# EAGLE design 1541-II multi-ROM Rev2 (EAGLE 9.7.0)
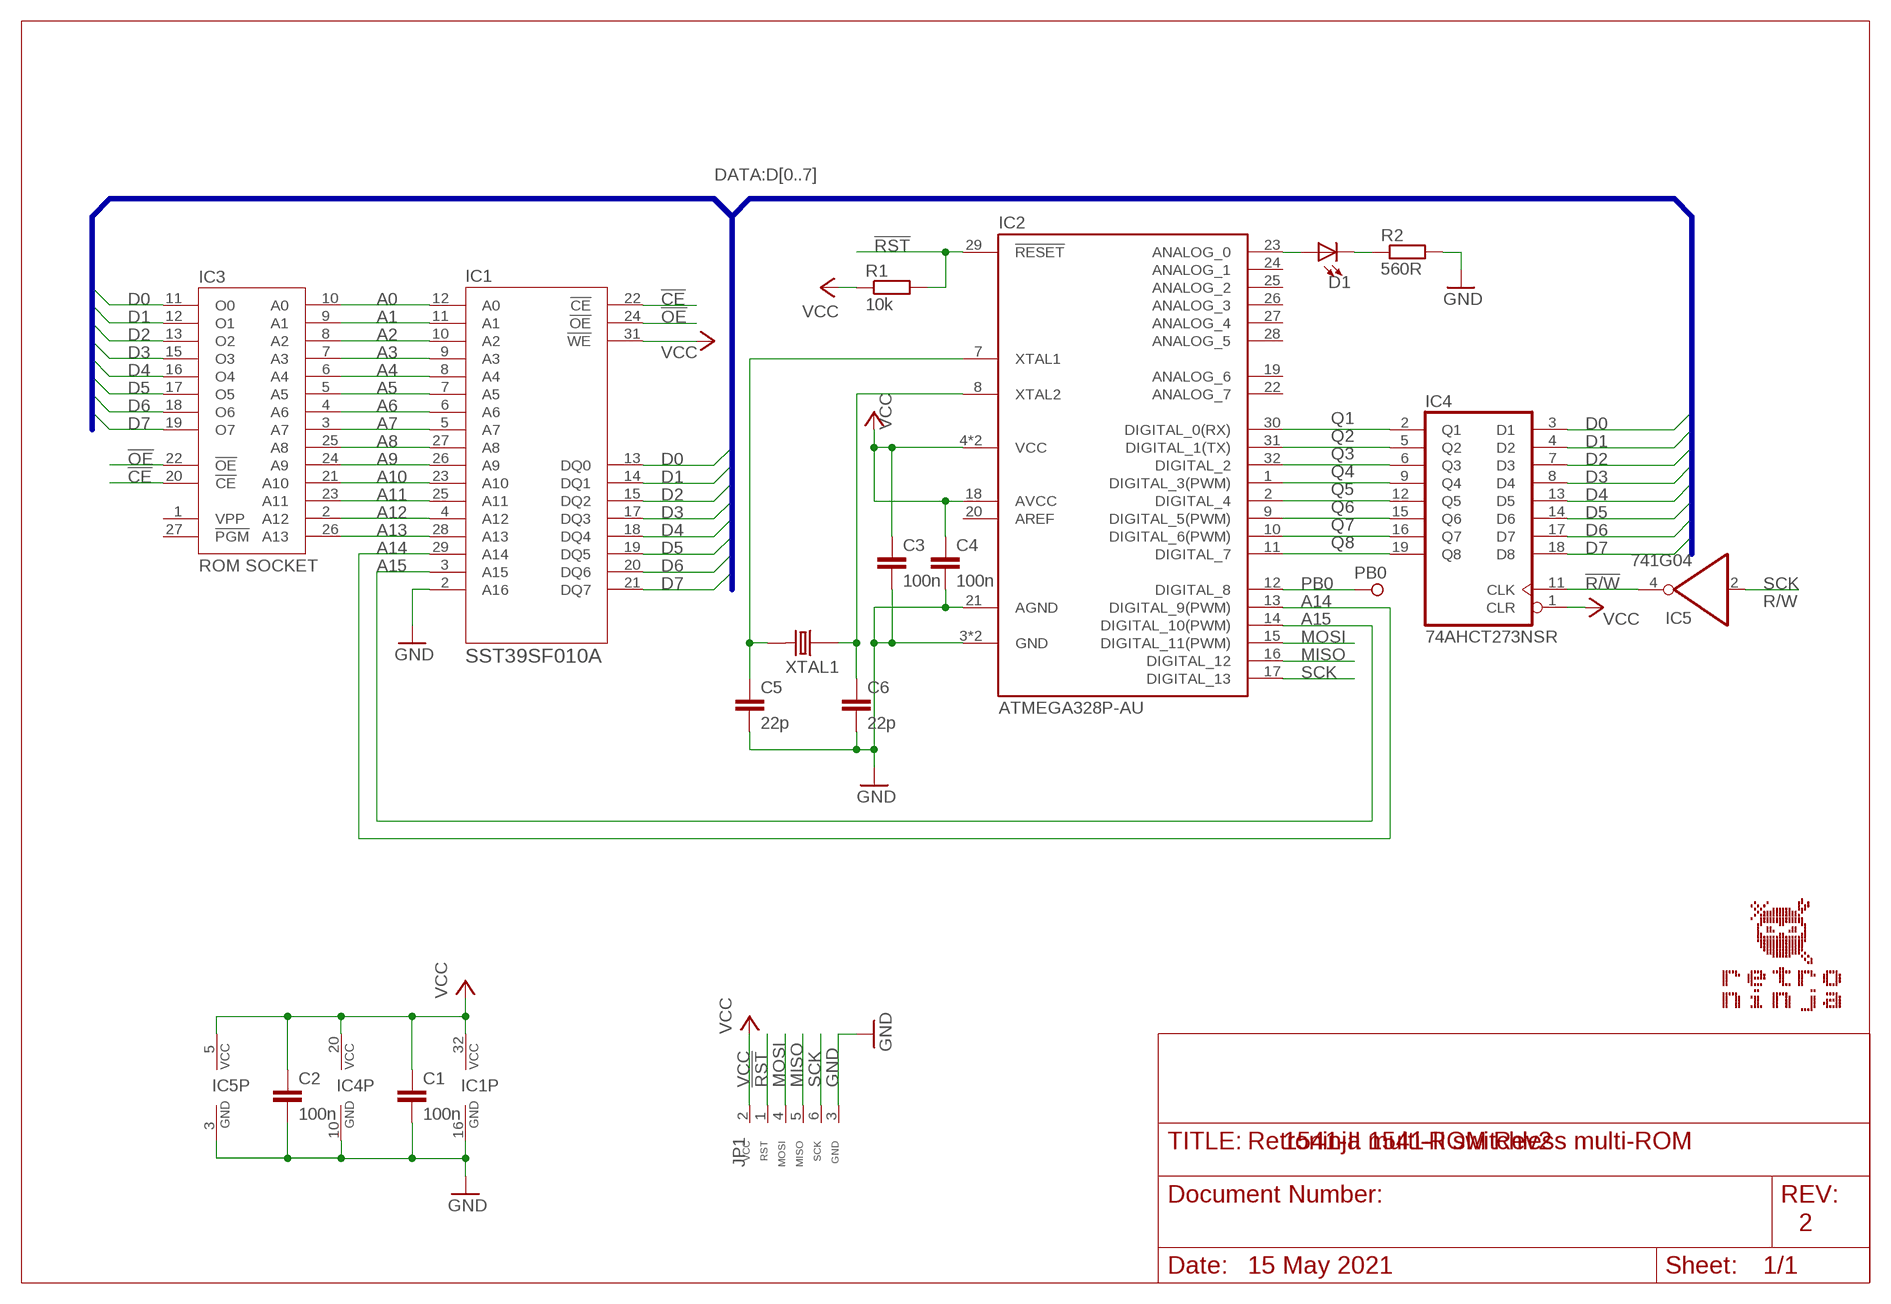
[diagram p0: schematic, sheet 1]

## Parts
C1  100n  C-EUC0805  [C0805]
C2  100n  C-EUC0805  [C0805]
C3  100n  C-EUC0805  [C0805]
C4  100n  C-EUC0805  [C0805]
C5  22p  C-EUC0805  [C0805]
C6  22p  C-EUC0805  [C0805]
D1  LED_1206  [LED1206]
IC1  SST39SF010A  SST39XX010_PLCC_SHORT  [PLCC32_SHORT]
IC2  ATMEGA328P-AU  ARDUINO_168_328_TQFP  [TQFP32]
IC3  ROM SOCKET  27C128_DOWNPINS  [DIL28-6_DOWNPINS]
IC4  74AHCT273NSR  74273NS  [SO20]
IC5  741G04  741G04_SOT23  [SOT23-5]
JP1  ICSP_CONNECTOR_TL866_RIGHT2  [HEADER_1X6_RIGHT]
PB0  TEST_POINT_TH  [TEST_POINT_TH]
R1  10k  R-EU_R0805  [R0805]
R2  560R  R-EU_R0805  [R0805]
XTAL1  CRYSTAL  [CRYSTAL_SMD-2_7X4X2.3]

## Nets
!CE: IC1.22(!CE) IC3.20(!CE)
!OE: IC1.24(!OE) IC3.22(!OE)
!R/W: IC4.11(CLK) IC5.4(O)
!RST: IC2.29(!RESET) JP1.1(RST) R1.2
A0: IC1.12(A0) IC3.10(A0)
A1: IC1.11(A1) IC3.9(A1)
A2: IC1.10(A2) IC3.8(A2)
A3: IC1.9(A3) IC3.7(A3)
A4: IC1.8(A4) IC3.6(A4)
A5: IC1.7(A5) IC3.5(A5)
A6: IC1.6(A6) IC3.4(A6)
A7: IC1.5(A7) IC3.3(A7)
A8: IC1.27(A8) IC3.25(A8)
A9: IC1.26(A9) IC3.24(A9)
A10: IC1.23(A10) IC3.21(A10)
A11: IC1.25(A11) IC3.23(A11)
A12: IC1.4(A12) IC3.2(A12)
A13: IC1.28(A13) IC3.26(A13)
A14: IC1.29(A14) IC2.13(DIGITAL_9(PWM))
A15: IC1.3(A15) IC2.14(DIGITAL_10(PWM))
D0: IC1.13(DQ0) IC3.11(O0) IC4.3(D1)
D1: IC1.14(DQ1) IC3.12(O1) IC4.4(D2)
D2: IC1.15(DQ2) IC3.13(O2) IC4.7(D3)
D3: IC1.17(DQ3) IC3.15(O3) IC4.8(D4)
D4: IC1.18(DQ4) IC3.16(O4) IC4.13(D5)
D5: IC1.19(DQ5) IC3.17(O5) IC4.14(D6)
D6: IC1.20(DQ6) IC3.18(O6) IC4.17(D7)
D7: IC1.21(DQ7) IC3.19(O7) IC4.18(D8)
GND: C1.2 C2.2 C3.2 C4.2 C5.2 C6.2 IC1.2(A16) IC1.16(GND) IC2.3(GND) IC2.5(GND) IC2.21(AGND) IC4.10(GND) IC5.3(GND) JP1.3(GND) R2.2
MISO: IC2.16(DIGITAL_12) JP1.5(MISO)
MOSI: IC2.15(DIGITAL_11(PWM)) JP1.4(MOSI)
N$16: C6.1 IC2.8(XTAL2) XTAL1.1
N$17: C5.1 IC2.7(XTAL1) XTAL1.2
N$25: D1.A IC2.23(ANALOG_0)
N$26: D1.C R2.1
PB0: IC2.12(DIGITAL_8) PB0.P$1(TP)
Q1: IC2.30(DIGITAL_0(RX)) IC4.2(Q1)
Q2: IC2.31(DIGITAL_1(TX)) IC4.5(Q2)
Q3: IC2.32(DIGITAL_2) IC4.6(Q3)
Q4: IC2.1(DIGITAL_3(PWM)) IC4.9(Q4)
Q5: IC2.2(DIGITAL_4) IC4.12(Q5)
Q6: IC2.9(DIGITAL_5(PWM)) IC4.15(Q6)
Q7: IC2.10(DIGITAL_6(PWM)) IC4.16(Q7)
Q8: IC2.11(DIGITAL_7) IC4.19(Q8)
SCK: IC2.17(DIGITAL_13) IC5.2(I) JP1.6(SCK)
VCC: C1.1 C2.1 C3.1 C4.1 IC1.31(!WE) IC1.32(VCC) IC2.4(VCC) IC2.6(VCC) IC2.18(AVCC) IC4.1(CLR) IC4.20(VCC) IC5.5(VCC) JP1.2(VCC) R1.1
Unconnected: IC2.19(ANALOG_6) IC2.20(AREF) IC2.22(ANALOG_7) IC2.24(ANALOG_1) IC2.25(ANALOG_2) IC2.26(ANALOG_3) IC2.27(ANALOG_4) IC2.28(ANALOG_5) IC3.1(VPP) IC3.27(!PGM)

## Buses
DATA:D[0..7]

## Notes on the sheet
- R/W
- Retroninja 1541-II switchless multi-ROM
- 2
- 15 May 2021

## Power pins joined to a net without a drawn wire
GND: IC3.14(GND)
VCC: IC3.28(VCC)

## Library data of the parts
C1-C6 = rcl:C-EU: CAPACITOR, European symbol; SPICEPREFIX: C
D1 = Per (Fusion 360):LED
IC1 = Per (Fusion 360):SST39XX010
IC2 = Per (Fusion 360):ARDUINO_168_328
IC3 = Per (Fusion 360):27C128
IC4 = Per (Fusion 360):74*273
IC5 = Per (Fusion 360):74*1G04
JP1 = Per (Fusion 360):ICSP_CONNECTOR: PIN HEADER
PB0 = Per (Fusion 360):TEST_POINT
R1 R2 = rcl:R-EU_: RESISTOR, European symbol; SPICEPREFIX: R
XTAL1 = Per (Fusion 360):CRYSTAL

## Board
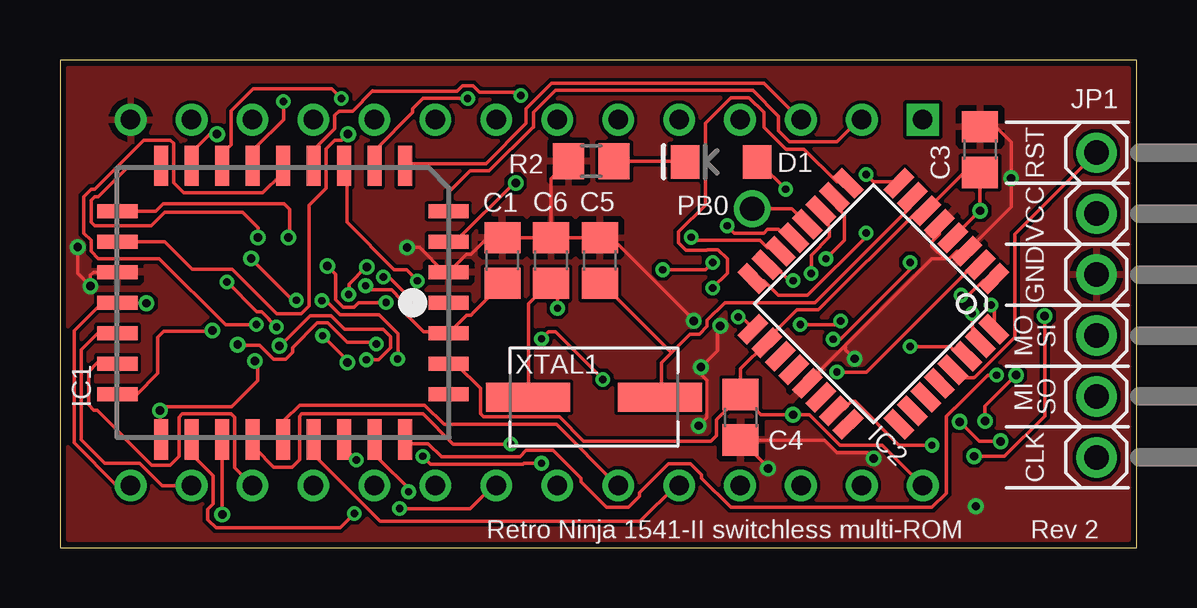
[diagram p1: board, top side]
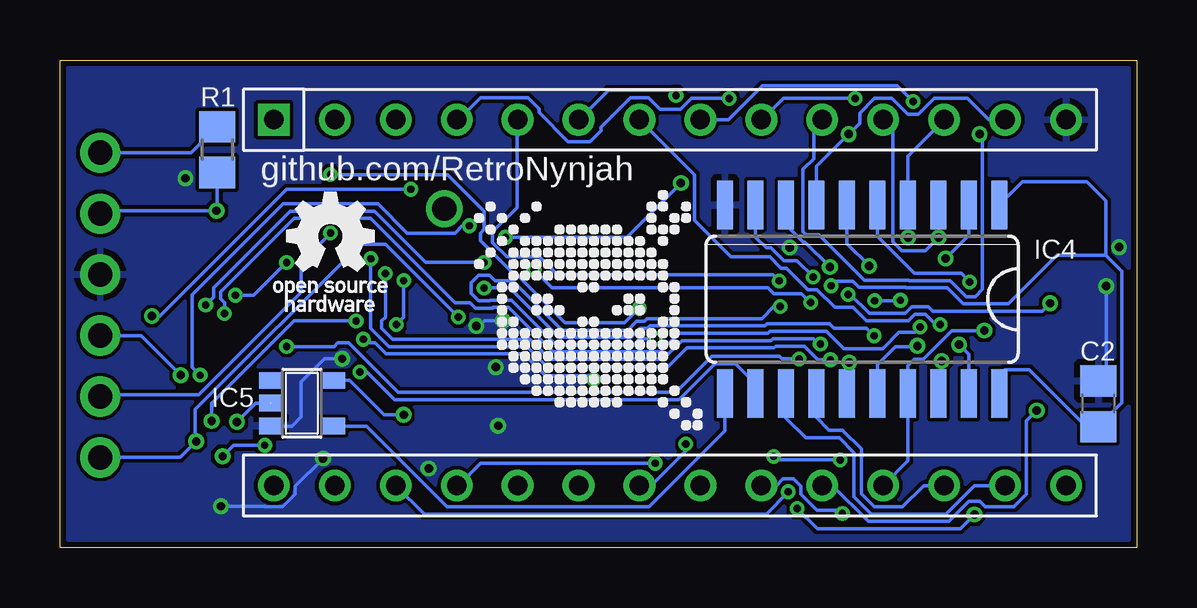
[diagram p2: board, bottom side, seen from below]

Size 44.88 x 20.32 mm. Coordinates in mm from the lower left corner, seen from the top.
Outline: 0,0 44.88,0 44.88,20.32 0,20.32 0,0
Copper layers (1*16): Top 0.035mm / dielectric 1.5mm / Bottom 0.035mm
Design rules "SeeedStudio_2layer_DRU_no_angle_20140221": minimum track width 6mil, minimum drill 12mil, track to track 6mil, track to pad 6mil, pad to pad 6mil, via to via 6mil, smd to smd 0mil, copper to edge 10mil, drill to drill 10mil, minimum pad ring 10mil, minimum via ring 6mil, stop-mask expansion 2mil, vias tented up to drill 100mil, thermal gap 10mil

### Footprints (pad centres in the part's own frame; a part is rotated, then mirrored left to right if it is on the bottom)
C0805 = smd 1.3 x 1.5: 1 -0.95,0; 2 0.95,0
LED1206 = smd 1.2 x 1.4: A -1.5,0; C 1.5,0
PLCC32_SHORT = smd 0.584 x 1.676: 1 0,6.9; 2 -1.27,6.9; 3 -2.54,6.9; 4 -3.81,6.9; 14 -3.81,-6.9; 15 -2.54,-6.9; 16 -1.27,-6.9; 17 0,-6.9; 18 1.27,-6.9; 19 2.54,-6.9; 20 3.81,-6.9; 30 3.81,6.9; 31 2.54,6.9; 32 1.27,6.9 | smd 1.676 x 0.584: 5 -5.7,5.08; 6 -5.7,3.81; 7 -5.7,2.54; 8 -5.7,1.27; 9 -5.7,0; 10 -5.7,-1.27; 11 -5.7,-2.54; 12 -5.7,-3.81; 13 -5.7,-5.08; 21 5.7,-5.08; 22 5.7,-3.81; 23 5.7,-2.54; 24 5.7,-1.27; 25 5.7,0; 26 5.7,1.27; 27 5.7,2.54; 28 5.7,3.81; 29 5.7,5.08
TQFP32 = smd 1.27 x 0.559: 1 -4.293,2.8; 2 -4.293,2; 3 -4.293,1.2; 4 -4.293,0.4; 5 -4.293,-0.4; 6 -4.293,-1.2; 7 -4.293,-2; 8 -4.293,-2.8; 17 4.293,-2.8; 18 4.293,-2; 19 4.293,-1.2; 20 4.293,-0.4; 21 4.293,0.4; 22 4.293,1.2; 23 4.293,2; 24 4.293,2.8 | smd 0.559 x 1.27: 9 -2.8,-4.293; 10 -2,-4.293; 11 -1.2,-4.293; 12 -0.4,-4.293; 13 0.4,-4.293; 14 1.2,-4.293; 15 2,-4.293; 16 2.8,-4.293; 25 2.8,4.293; 26 2,4.293; 27 1.2,4.293; 28 0.4,4.293; 29 -0.4,4.293; 30 -1.2,4.293; 31 -2,4.293; 32 -2.8,4.293
DIL28-6_DOWNPINS = drill 0.813 square: 1 -16.51,-7.62 | drill 0.813: 2 -13.97,-7.62; 3 -11.43,-7.62; 4 -8.89,-7.62; 5 -6.35,-7.62; 6 -3.81,-7.62; 7 -1.27,-7.62; 8 1.27,-7.62; 9 3.81,-7.62; 10 6.35,-7.62; 11 8.89,-7.62; 12 11.43,-7.62; 13 13.97,-7.62; 14 16.51,-7.62; 15 16.51,7.62; 16 13.97,7.62; 17 11.43,7.62; 18 8.89,7.62; 19 6.35,7.62; 20 3.81,7.62; 21 1.27,7.62; 22 -1.27,7.62; 23 -3.81,7.62; 24 -6.35,7.62; 25 -8.89,7.62; 26 -11.43,7.62; 27 -13.97,7.62; 28 -16.51,7.62
SO20 = smd 0.66 x 2.032: 1 -5.369,-4.019; 2 -4.099,-4.019; 3 -2.829,-4.019; 4 -1.559,-4.019; 5 -0.289,-4.019; 6 0.981,-4.019; 7 2.251,-4.019; 8 3.521,-4.019; 9 4.791,-4.019; 10 6.061,-4.019; 11 6.061,3.839; 12 4.791,3.839; 13 3.521,3.839; 14 2.251,3.839; 15 0.981,3.839; 16 -0.289,3.839; 17 -1.559,3.839; 18 -2.829,3.839; 19 -4.099,3.839; 20 -5.369,3.839
SOT23-5 = smd 0.69 x 0.99: 1 -0.95,-1.29; 2 0,-1.29; 3 0.95,-1.29; 4 0.95,1.3; 5 -0.95,1.3
HEADER_1X6_RIGHT = drill 1.016 pad 1.676: 1 -6.35,-1.27; 2 -3.81,-1.27; 3 -1.27,-1.27; 4 1.27,-1.27; 5 3.81,-1.27; 6 6.35,-1.27
TEST_POINT_TH = drill 1.016: P$1 0,0
R0805 = smd 1.3 x 1.5: 1 -0.95,0; 2 0.95,0
CRYSTAL_SMD-2_7X4X2.3 = smd 3.5 x 1.2: 1 -2.75,0; 2 2.75,0

### Placement (x,y rotation side)
C1  18.44,11.96 90 top
C2  1.6,5.99 90 bottom
C3  38.35,16.59 90 top
C4  28.37,5.44 270 top
C5  22.5,11.96 90 top
C6  20.47,11.96 90 top
D1  27.56,16.08 180 top
IC1  9.3,10.21 270 top
IC2  33.91,10.16 225 top
IC3  19.46,10.21 180 top
IC4  11.1,10.26 180 bottom
IC5  34.8,6.02 270 bottom
JP1  44.48,10.11 270 top
PB0  28.85,14.12 0 top
R1  38.33,16.59 90 bottom
R2  22.15,16.1 180 top
U$1  [RETRONINJA_NOTEXT_10MM]  22.86,10.13 0 bottom
U$2  [OSHW_5MM]  35.99,9.83 0 bottom
XTAL1  22.25,6.27 0 top

### Tracks (layer width: path | path; a pad name or v marks a point on that pad's centre or on a via)
!CE  (via drill 0.3)
  Top 0.152: IC1.22 5.56,4.42 5.56,3.81 6.38,3 6.38,1.82 6.16,1.61 6.16,1.17 6.51,0.82 11.67,0.82 v12.27,1.42 | v12.27,1.42
  Bottom 0.152: v12.27,1.42 12.41,1.56 13.33,1.56 13.99,2.22 13.99,2.55 14.31,2.86 14.75,2.86 15.02,2.59 IC3.20
!OE  (via drill 0.3)
  Top 0.152: IC1.24 8.15,4.42 8.15,4.12 8.91,3.35 9.68,3.35 9.98,3.66 9.98,5.49 10.07,5.58 15.13,5.58 16.39,4.32 v18.79,4.32
  Bottom 0.152: v18.79,4.32 18.79,4.04 20.25,2.59 IC3.22
!R/W
  Bottom 0.152: IC5.4 32.11,5.07 28.74,1.7 20.33,1.7 17.16,4.87 IC4.11
!RST
  Top 0.152: IC2.29 37.26,7.32 37.52,7.32 37.74,7.09 38.1,7.09 38.11,7.1 38.14,7.1 39.8,8.76 39.8,13.05 JP1.1
  Bottom 0.152: R1.2 39.41,16.46 JP1.1
A0  (via drill 0.35)
  Top 0.152: v6.55,17.23 6.24,17.23 5.49,16.47 IC1.12
  Bottom 0.152: IC3.10 13.46,17.48 13.46,16.21 13.91,15.76 13.91,13.17 13.78,13.04 13.24,13.04 11.35,11.15 9.51,11.15 9.48,11.12 7.76,11.12 7.1,10.46 6.73,10.46 6.43,10.77 6.43,17.01 6.55,17.13 v6.55,17.23
A1  (via drill 0.3)
  Top 0.152: v11.73,18.72 11.33,19.12 8.06,19.12 7.14,18.2 7.14,16.79 6.76,16.41 IC1.11
  Bottom 0.152: IC3.9 15.62,17.83 14.73,18.72 v11.73,18.72
A2  (via drill 0.3)
  Top 0.152: IC1.10 8.15,16 8.15,16.68 9.31,17.84 v9.31,18.59
  Bottom 0.152: IC3.8 17.02,17.83 15.6,19.25 9.98,19.25 v9.31,18.59
A3  (via drill 0.3)
  Top 0.152: IC1.9 9.22,15.85 9.22,15.54 8.46,14.78 5.16,14.78 4.74,15.21 4.74,16.84 4.6,16.98 3.49,16.98 1.45,14.94 1.29,14.94 0.99,14.63 0.99,13.11 1.29,12.8 1.29,12.34 1.6,12.04 4.14,12.04 6.9,9.28 8.17,9.28 v8.19,9.3
  Bottom 0.152: v8.19,9.3 8.38,9.3 8.81,9.73 9.25,9.73 9.52,9.45 11.27,9.45 11.82,10.01 12.59,10.01 13.33,10.75 13.7,10.75 14.61,11.65 14.83,11.65 15.29,12.11 16.91,12.11 18.44,13.64 18.44,15.54 IC3.7
A4  (via drill 0.3)
  Top 0.152: IC1.8 10.59,16 10.59,16.6 11.46,17.46 11.46,18.01 11.63,18.19 12.19,18.19 13.04,19.03 13.05,19.02 16.54,19.02 16.77,19.25 17.21,19.25 17.48,18.98 19.07,18.98 v19.2,18.85
  Bottom 0.152: v19.2,18.85 19.41,19.05 22.02,19.05 23.24,17.83 IC3.6
A5  (via drill 0.3)
  Top 0.152: IC1.7 11.96,15.85 11.96,13.55 13.94,11.58 14.44,11.58 v14.9,11.12
  Bottom 0.152: IC3.5 25.83,17.83 25.83,14.17 26.84,13.16 26.84,12.71 26.25,12.12 24.89,12.12 24.15,11.37 15.15,11.37 v14.9,11.12
A6  (via drill 0.3)
  Top 0.152: v16.99,18.72 15.14,18.72 14.71,18.29 14.71,18.14 13.18,16.61 13.18,16 IC1.6
  Bottom 0.152: v16.99,18.72 18.57,18.72 19.02,18.26 19.86,18.26 20.34,18.75 21.11,18.75 22.33,17.53 22.33,17.37 22.78,16.92 23.7,16.92 24.92,18.14 24.92,18.29 25.38,18.75 27.36,18.75 28.27,17.83 IC3.4
A7
  Top 0.152: IC1.5 14.4,16 17.75,16 19.43,17.68 19.43,18.29 20.5,19.36 29.34,19.36 30.86,17.83 IC3.3
A8  (via drill 0.3)
  Top 0.152: IC1.27 11.84,4.16 12.34,3.66 v12.36,3.66 | v20.07,3.52 19.33,3.52 19.3,3.48 15.45,3.48 v15.13,3.81
  Bottom 0.152: IC3.25 28.27,2.59 27.34,3.52 v20.07,3.52 | v15.13,3.81 14.97,3.66 v12.36,3.66
A9
  Top 0.152: IC1.26 10.59,4.42 10.59,3.85 13.35,1.09 24.18,1.09 25.68,2.59 IC3.24
A10  (via drill 0.3, 0.35)
  Top 0.152: IC3.21 18.06,2.59 17.1,1.63 v14.15,1.63 | IC1.23 6.76,1.73 6.76,1.72 v6.76,1.38
  Bottom 0.152: v6.76,1.38 7.36,0.79 13.31,0.79 v14.15,1.63
A11
  Top 0.152: IC1.25 9.37,4.57 9.37,5.33 9.98,5.94 15.2,5.94 16,5.14 20.69,5.14 23.24,2.59 IC3.23
A12
  Top 0.152: IC3.2 33.3,17.83 32.38,16.92 30.4,16.92 29.95,17.37 29.95,17.98 28.88,19.05 20.65,19.05 19.74,18.14 19.74,17.53 19.71,17.53 17.88,15.7 17.09,15.7 16.2,14.8 IC1.4
A13  (via drill 0.3)
  Top 0.152: IC1.28 13.18,4.42 13.18,3.81 14.69,2.3 14.56,2.3 v14.53,2.33
  Bottom 0.152: IC3.26 29.69,1.4 15.44,1.4 14.53,2.31 v14.53,2.33
A14  (via drill 0.3)
  Top 0.152: v27.81,13.41 28.12,13.11 29.34,13.11 29.49,13.26 29.95,13.26 30.25,12.95 30.56,12.95 IC2.13 | v39.04,7.19 38.68,7.19 37.3,5.8 37.27,5.8 36.95,5.47 36.95,2.28 36.35,1.68 27.96,1.68 26.75,2.9 26.75,3.05 26.29,3.5 25.38,3.5 24.16,2.29 24.16,2.13 23.7,1.68 22.78,1.68 21.72,2.74 21.72,2.9 20.56,4.05 19.44,4.05 19.17,3.79 15.9,3.79 15.35,4.34 14.48,4.34 14.4,4.42 IC1.29
  Bottom 0.152: v27.81,13.41 28.12,13.41 28.42,13.11 30.4,13.11 31.62,14.33 35.59,14.33 39.37,10.54 39.37,7.52 v39.04,7.19
A15  (via drill 0.3, 0.35)
  Top 0.152: IC2.14 29.95,12.5 29.49,12.5 29.18,12.8 26.44,12.8 v26.31,12.93 | IC1.3 16.23,12.8 16.54,12.8 18.92,15.19 v19,15.19
  Bottom 0.152: v19,15.19 21.25,12.93 v26.31,12.93
D0  (via drill 0.35)
  Top 0.152: IC1.13 4.19,15.85 2.82,15.85 1.6,14.63 1.45,14.63 1.29,14.48 1.29,13.56 1.45,13.41 3.81,13.41 4.37,13.97 7.62,13.97 8.26,13.34 v8.26,12.93
  Bottom 0.152: IC4.3 8.26,14.27 v8.26,12.93 8.81,12.37 9.78,12.37 10.16,12.75 10.16,17.42 IC3.11
D1  (via drill 0.35)
  Top 0.152: v9.53,12.93 9.58,12.98 9.58,14.1 9.35,14.33 4.29,14.33 3.99,14.02 IC1.14
  Bottom 0.152: v9.53,12.93 9.53,14.27 IC4.4 9.54,16.32 IC3.12
D2  (via drill 0.35)
  Top 0.152: IC1.15 4.37,12.75 5.51,11.61 7.18,11.61 9.04,9.75 10.05,9.75 10.39,10.09 10.39,14.28 11.09,14.98 11.09,16.61 11.45,16.98 11.74,16.98 12,17.23 v12.01,17.23
  Bottom 0.152: IC3.13 6.17,17.83 7.06,18.72 8.43,18.72 9.09,18.06 9.54,18.06 10.2,18.72 10.94,18.72 11.55,18.11 11.55,17.69 v12.01,17.23 13.35,15.89 IC4.7
D3  (via drill 0.3, 0.35)
  Top 0.152: IC3.15 2.36,2.59 0.58,4.37 0.58,9.04 1.75,10.21 IC1.17 2.42,10.19 v3.61,10.19 | v12.03,10.54 12.05,10.56 12.05,10.98 12.77,11.7 v12.79,11.7
  Bottom 0.152: IC4.8 14.62,13.45 13.9,12.73 13.82,12.73 v12.79,11.7 | v12.03,10.54 11.93,10.54 11.14,9.76 9.65,9.76 9.38,10.03 8.68,10.03 8.5,9.86 5.08,9.86 4.65,9.86 3.94,9.86 v3.61,10.19
D4
  Top 0.152: IC1.18 1.57,8.94 0.89,8.26 0.89,4.5 1.87,3.52 3.32,3.52 4.25,2.59 IC3.16
  Bottom 0.152: IC3.16 6.77,2.59 7.96,1.4 11.06,1.4 11.79,2.12 11.79,3.96 12.39,4.57 13.79,4.57 14.62,5.4 IC4.13
D5
  Top 0.152: IC1.19 2.44,7.7 1.56,7.7 1.19,7.34 1.19,5.95 1.41,5.73 1.55,5.73 3.83,3.44 4.6,3.44 4.97,3.81 4.97,5.44 5.1,5.58 7.14,5.58 7.28,5.44 7.28,3.34 IC3.17
  Bottom 0.152: IC3.17 8.88,2.59 9.77,1.7 10.94,1.7 11.48,2.25 11.48,4.12 12.27,4.9 12.83,4.9 13.35,5.43 IC4.14
D6  (via drill 0.35)
  Top 0.152: IC1.20 3.21,6.4 4.08,7.27 4.08,8.77 4.33,9.02 6.32,9.02 v6.35,9.05
  Bottom 0.152: v6.35,9.05 7.7,9.05 8.89,7.85 9.27,7.85 9.54,7.58 IC4.17 9.54,3.62 IC3.18
D7  (via drill 0.35)
  Top 0.152: v8.13,7.78 8.23,7.68 8.23,6.96 7.15,5.88 4.33,5.88 v4.17,5.71 v4.18,5.7 4.18,4.55 IC1.21
  Bottom 0.152: IC3.19 12.69,2.59 11.19,1.09 7.84,1.09 6.99,1.94 6.53,1.94 6.3,1.7 5.12,1.7 4.6,2.22 4.6,5.28 v4.17,5.71 | IC4.18 8.27,6.97 8.13,7.11 v8.13,7.78
GND  (via drill 0.35)
  Top 0.152: IC2.3 38.15,12.7 | C3.2 39,17.54 39.65,16.89 v39.65,15.39 39.65,14.2 IC2.3 | C6.2 C1.2 17.81,12.91 17.13,12.23 16.95,12.23 IC1.2 16.01,11.48 14.98,12.51 v14.47,12.51 | C6.2 C5.2 22.99,12.91 26.21,9.69 26.21,9.65 v26.42,9.45 | IC1.16 1.4,11.48 1.27,11.35 v1.27,10.9 0.74,11.43 v0.74,12.52 | C6.2 20.47,15.38 R2.2 | 36.88,12.04 36.35,12.57 36.35,12.76 36.66,13.06 IC2.5 | 36.88,12.04 37.07,12.04 37.38,12.35 IC2.3 | 32.74,8.43 IC2.21 | 32.74,8.43 36.35,12.04 36.88,12.04 | v33.92,3.71 33.66,3.96 32.38,3.96 31.86,4.49 C4.2 29.52,3.34 v29.52,3.3 | v33.12,7.87 32.74,8.25 32.74,8.43 | v26.62,5.08 26.98,5.44 26.98,6.97 26.72,7.23 v26.72,7.52 27.4,8.2 27.4,9.12 v27.53,9.24
  Bottom 0.152: C2.2 1.27,7.28 v1.27,10.9 | IC5.3 35.2,5.07 34.82,5.45 34.82,6.91 33.86,7.87 v33.12,7.87 | v33.92,3.71 35.08,2.55 35.08,2.22 35.6,1.7 36.34,1.7 36.36,1.73 v38.18,1.73 | v27.53,9.24 27.4,9.24 27.19,9.45 v26.42,9.45
  pour Top: 44.91,20.4 -0.08,20.4 -0.08,-0.08 44.91,-0.08
  pour Bottom: 44.91,20.47 -0.08,20.47 -0.08,-0.08 44.91,-0.08
MISO  (via drill 0.3)
  Top 0.152: v33.6,13.11 33.6,12.95 31.17,10.52 29.95,10.52 29.34,11.12 29.03,11.12 IC2.16
  Bottom 0.152: v33.6,13.11 34.82,11.89 34.82,10.64 39.09,6.38 43.13,6.38 JP1.5
MOSI  (via drill 0.3, 0.35)
  Top 0.152: v30.56,11.12 30.4,11.12 29.79,11.73 29.49,11.73 IC2.15 | v30.86,9.3 32.38,9.3 v32.54,9.45 | v38.56,5.28 38.56,5.89 v39.85,7.19
  Bottom 0.152: v30.56,11.12 30.56,9.6 v30.86,9.3 | v32.54,9.45 35.13,9.45 38.56,6.02 v38.56,5.28 | v39.85,7.19 41.5,8.84 JP1.4
N$16  (via drill 0.3)
  Top 0.152: v33.6,15.54 33.91,15.24 34.82,15.24 IC2.8 | XTAL1.1 19.53,6.31 19.53,10.16 20.34,10.97 C6.1 20.74,10.75 v20.74,9.97
  Bottom 0.152: v33.6,15.54 28.73,15.54 27.2,14.02 27.2,13.26 27.36,13.11 27.36,12.79 25.99,11.43 25.88,11.43 23.83,9.37 21.34,9.37 v20.74,9.97
N$17
  Top 0.152: 25.49,8.12 25.07,7.7 25.07,6.4 XTAL1.2 | IC2.7 35.43,14.48 35.43,14.17 31.47,10.21 27.71,10.21 26.97,9.47 26.97,9.22 26.65,8.9 26.27,8.9 25.49,8.12 | 25.49,8.12 22.63,10.97 C5.1
N$25  (via drill 0.3, 0.35)
  Top 0.152: v36.35,4.27 34.98,4.27 33.15,6.1 32.99,6.1 32.69,5.79 32.38,5.79 IC2.23 | v30.25,14.94 29.18,16 D1.A | v38.1,3.81 39.37,3.81 41.05,5.49 v41.05,9.65
  Bottom 0.152: v30.25,14.94 35.43,14.94 40.72,9.65 v41.05,9.65 | v36.35,4.27 37.64,4.27 v38.1,3.81
N$26
  Top 0.152: R2.1 26.03,16.1 D1.C
PB0
  Top 0.152: IC2.12 30.51,14.12 PB0.P$1
Q1  (via drill 0.3, 0.35)
  Top 0.152: v35.43,8.38 37.11,8.38 37.41,8.08 37.72,8.08 IC2.30 | v10.92,10.29 11.1,10.29 11.69,9.71 13.3,9.71 14.09,8.92 14.09,7.88 v14.07,7.87 | v7.97,12.05 9.71,10.31 v9.85,10.31
  Bottom 0.152: v35.43,8.38 33.45,8.38 33.3,8.53 32.84,8.53 30.79,6.48 19.21,6.48 17.71,7.97 14.89,7.97 14.78,7.87 v14.07,7.87 | v7.97,12.05 7,13.01 IC4.2 | v10.92,10.29 9.87,10.29 v9.85,10.31
Q2  (via drill 0.3)
  Top 0.152: v38.02,9.75 38.02,8.99 38.33,8.69 IC2.31 | v6.96,11.07 8.2,9.84 8.41,9.84 8.73,9.53 8.73,9.5 v9.03,9.2
  Bottom 0.152: v38.02,9.75 38.02,10.21 38.18,10.36 38.18,10.67 35.13,13.72 31.93,13.72 28.42,10.21 27.78,10.21 27.55,9.98 26.86,9.98 26.83,10.01 26.19,10.01 24.33,8.15 19.87,8.15 19.09,8.93 15.37,8.93 15.28,9.02 12.93,9.02 12.21,8.3 10.58,8.3 9.9,8.97 9.26,8.97 v9.03,9.2 | v6.96,11.07 7.32,11.43 9.27,11.43 10.81,12.97 IC4.5
Q3  (via drill 0.3, 0.35)
  Top 0.152: v38.81,10.11 38.94,9.98 38.94,9.14 IC2.32 | v25.12,11.58 26.9,11.58 v27.2,11.89 | v13.59,10.21 12.46,10.21 12.25,10.01 11.81,10.01 11.5,10.32 11.5,11.39 v11.15,11.74
  Bottom 0.152: v38.81,10.11 38.48,10.44 38.48,10.82 35.28,14.02 31.77,14.02 29.64,11.89 v27.2,11.89 | v25.12,11.58 24.38,10.84 15.38,10.84 15.12,10.59 13.97,10.59 13.83,10.44 13.82,10.44 v13.59,10.21 | v11.15,11.74 12.08,12.67 IC4.6
Q4  (via drill 0.3)
  Top 0.152: v37.57,10.52 37.87,10.52 38.48,11.12 38.79,11.12 IC2.1 | v35.43,11.89 35.43,11.58 32.54,8.69 v32.23,8.69 | v13.48,11.28 v13.49,11.28 13.72,11.28 14.86,10.13 v14.86,10.05 | v22.63,7.01 20.65,8.99 20.36,8.99 v20.07,8.7
  Bottom 0.152: v37.57,10.52 36.8,10.52 v35.43,11.89 | v32.23,8.69 32.08,8.53 31.75,8.53 31.29,8.08 25.55,8.08 24.63,7.16 22.78,7.16 v22.63,7.01 | v13.48,11.28 14.15,11.96 14.7,11.96 15.24,12.5 15.44,12.5 15.89,12.94 IC4.9 | v14.86,10.05 15.11,10.05 15.62,9.54 20.42,9.54 20.52,9.44 20.84,9.44 21.21,9.07 23.95,9.07 26.01,11.12 26.75,11.12 26.98,11.35 27.42,11.35 27.74,11.04 27.74,10.6 27.42,10.29 26.98,10.29 26.96,10.31 26.06,10.31 24.2,8.46 20.96,8.46 20.72,8.7 v20.07,8.7
Q5  (via drill 0.3)
  Top 0.152: v32.38,7.32 33.6,7.32 38.02,11.73 38.33,11.73 IC2.2
  Bottom 0.152: v32.38,7.32 32.08,7.32 30.94,6.17 19.08,6.17 17.59,7.67 16.74,7.67 15.89,6.82 IC4.12
Q6  (via drill 0.3, 0.35)
  Top 0.152: v27.2,10.82 27.81,11.43 27.81,12.03 27.42,12.42 26.98,12.42 26.96,12.4 26.09,12.4 25.78,12.71 25.78,13.15 26.9,14.28 26.9,17.68 27.96,18.75 28.73,18.75 29.34,18.14 29.34,17.53 30.25,16.61 31.01,16.61 32.38,15.24 32.84,15.24 IC2.9 | v11.98,7.72 11.98,7.79 v10.95,8.83
  Bottom 0.152: v27.2,10.82 26.14,10.82 24.08,8.76 21.09,8.76 20.71,9.14 20.39,9.14 20.29,9.24 15.49,9.24 15.41,9.33 12.81,9.33 12.63,9.15 11.27,9.15 v10.95,8.83 | IC4.15 12.08,7.62 v11.98,7.72
Q7  (via drill 0.3, 0.35)
  Top 0.152: v31.93,12.04 32.69,12.8 32.69,13.87 32.38,14.17 32.38,14.48 IC2.10 | v9.14,8.41 9.17,8.41 10.43,9.67 11.29,9.67 11.86,9.1 13.47,9.1 13.78,8.79 13.78,8.33 13.28,7.83 v12.77,7.83
  Bottom 0.152: v31.93,12.04 31.93,9.14 31.17,8.38 25.42,8.38 24.58,7.54 19.53,7.54 18.75,8.32 15.12,8.32 15.04,8.4 13.85,8.4 13.28,7.83 v12.77,7.83 | IC4.16 10.81,7.63 10.06,8.38 9.17,8.38 v9.14,8.41
Q8  (via drill 0.3, 0.35)
  Top 0.152: v31.32,11.43 31.32,12.19 32.08,12.95 32.08,13.41 31.77,13.72 31.77,14.02 IC2.11 | v7.41,8.46 7.42,8.45 8.32,8.45 8.91,7.86 9.4,7.86 9.7,8.15 9.7,8.34 10.72,9.36 11.17,9.36 11.96,8.57 13.1,8.57 v13.19,8.49
  Bottom 0.152: v31.32,11.43 31.32,9.6 31.47,9.45 31.47,9.14 31.01,8.69 25.3,8.69 24.46,7.85 19.74,7.85 18.96,8.63 15.24,8.63 15.17,8.71 13.47,8.71 13.25,8.49 v13.19,8.49 | IC4.19 7,8.05 v7.41,8.46
SCK  (via drill 0.3, 0.35)
  Top 0.152: IC2.17 28.88,9.14 28.42,9.6 v28.28,9.6 v28.27,9.61 | v37.5,5.24 38.32,4.43 v39.2,4.43
  Bottom 0.152: 39.24,4.39 39.24,5.77 32.36,12.65 31.32,12.65 v28.27,9.61 | 39.24,4.39 39.88,3.76 JP1.6 | IC5.2 36.73,6.02 v37.5,5.24 | 39.24,4.39 v39.2,4.43
VCC  (via drill 0.3, 0.35)
  Top 0.152: C4.1 29.22,5.54 v30.56,5.54 31.24,5.54 32.51,4.27 34.29,4.27 IC3.28 | C4.1 28.37,7.45 IC2.18 29.49,8.69 30.71,9.91 31.62,9.91 35.74,14.02 36.04,14.02 IC2.6 37.69,15.64 C3.1 v38.35,14.04 IC2.4 | IC1.32 16.95,9.69 17.13,9.69 17.26,9.82 17.26,9.84 C1.1 | IC1.32 16.23,8.84 16.23,7.77 IC1.31 16.23,7.62 16.54,7.62 17.52,6.63 17.52,5.58 17.66,5.45 20.82,5.45 21.82,4.45 27.13,4.45 27.36,4.67 27.36,5.33 28.27,6.25 C4.1 | IC1.32 16.08,8.99 15.16,8.99 14.25,9.91 14.25,10.31 13.81,10.75 12.94,10.75 12.77,10.91 v12.74,10.91
  Bottom 0.152: v30.56,5.54 31.38,5.54 32.81,6.97 IC5.5 | 1.29,12.19 1.29,14.45 2.08,15.24 4.77,15.24 IC4.1 | 1.29,12.19 0.61,11.51 0.61,6.03 C2.1 2.1,5.04 4.47,7.41 5.5,7.41 5.73,7.18 IC4.20 | 1.29,12.19 3.33,12.19 5.36,10.16 7.23,10.16 7.89,10.82 9.61,10.82 9.63,10.84 11.58,10.84 11.83,11.09 12.56,11.09 v12.74,10.91 | R1.1 38.33,14.06 v38.35,14.04 43.09,14.04 JP1.2

### Text on the board
tPlace: RST | VCC | GND | MO / SI | MI / SO | CLK | Retro Ninja 1541-II switchless multi-ROM | Rev 2
bPlace: github.com/RetroNynjah